# Altium schematic sheet Assistant_Parameters.SchDoc: EMRT MAIN CONTROLLER
size A4; DrawnBy: HUST; DocumentNumber: 9321-E-1101; Revision: REV.B; SheetNumber: 4; SheetTotal: 4
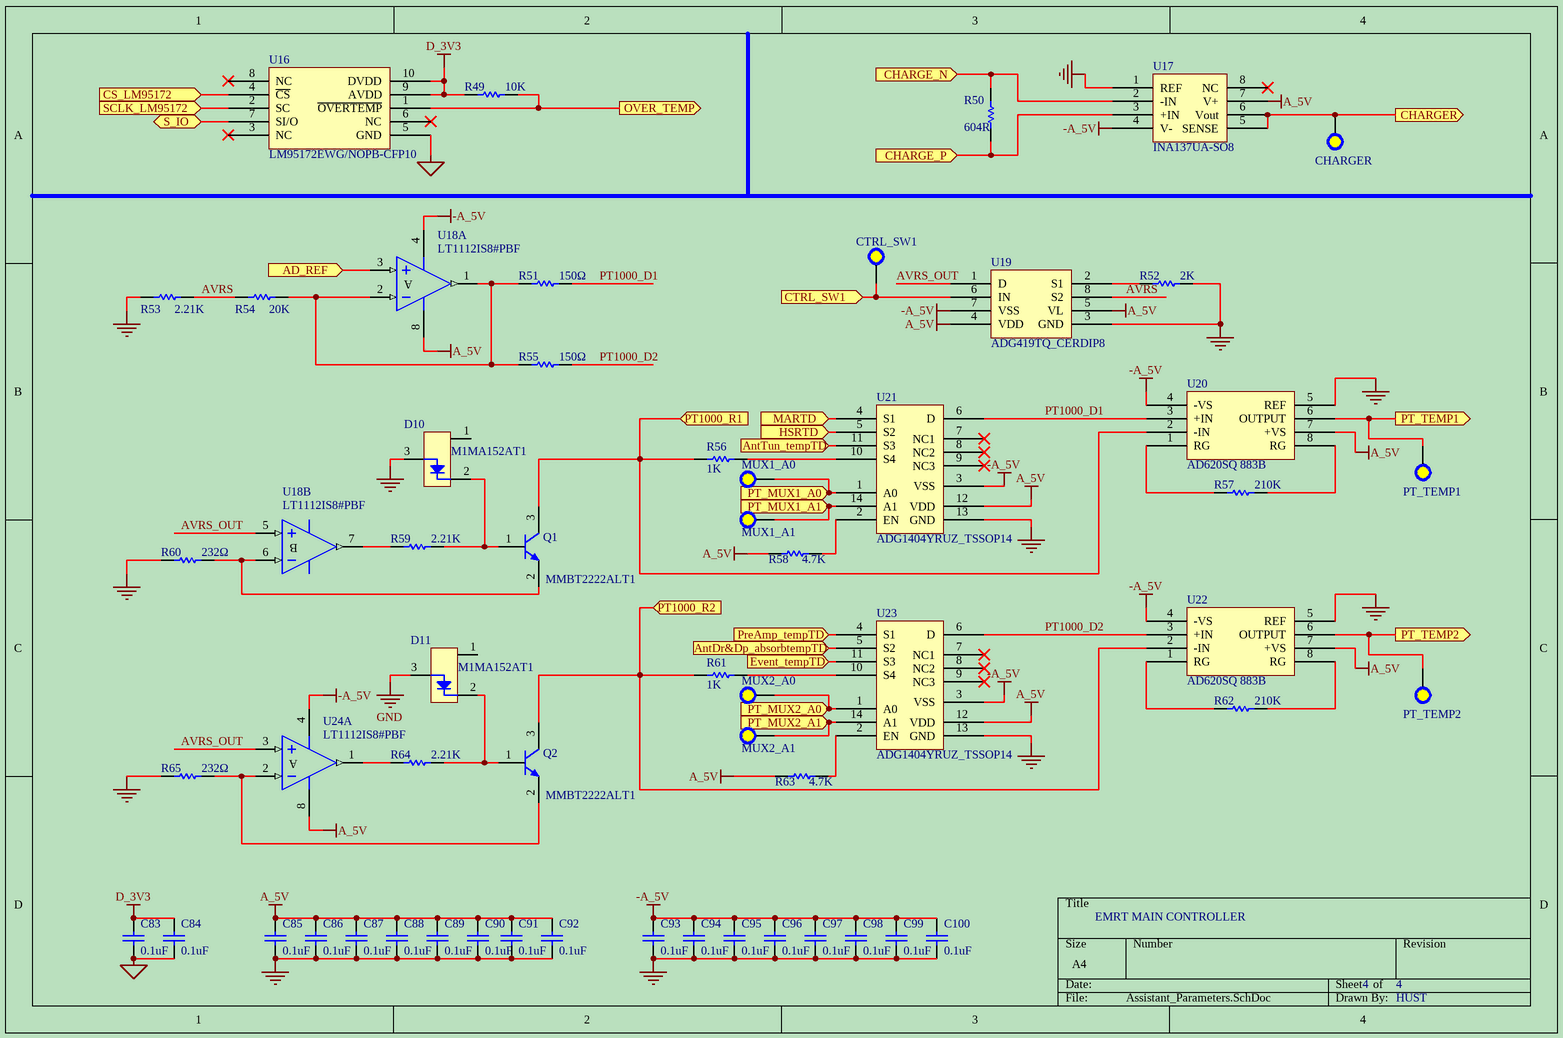
[diagram p0: Assistant_Parameters.SchDoc]

## Parts
C83  value 0.1uF  [CAPS0805_57]  (hidden comment: Cap)
C84  value 0.1uF  [CAPS0805_57]  (hidden comment: Cap)
C85  value 0.1uF  [CAPS0805_57]  (hidden comment: Cap)
C86  Cap  [CAPS0805_57]  (value not drawn)
C87  value 0.1uF  [CAPS0805_57]  (hidden comment: Cap)
C88  value 0.1uF  [CAPS0805_57]  (hidden comment: Cap)
C89  value 0.1uF  [CAPS0805_57]  (hidden comment: Cap)
C90  value 0.1uF  [CAPS0805_57]  (hidden comment: Cap)
C91  value 0.1uF  [CAPS0805_57]  (hidden comment: Cap)
C92  value 0.1uF  [CAPS0805_57]  (hidden comment: Cap)
C93  value 0.1uF  [CAPS0805_57]  (hidden comment: Cap)
C94  Cap  [CAPS0805_57]  (value not drawn)
C95  value 0.1uF  [CAPS0805_57]  (hidden comment: Cap)
C96  value 0.1uF  [CAPS0805_57]  (hidden comment: Cap)
C97  value 0.1uF  [CAPS0805_57]  (hidden comment: Cap)
C98  value 0.1uF  [CAPS0805_57]  (hidden comment: Cap)
C99  value 0.1uF  [CAPS0805_57]  (hidden comment: Cap)
C100  value 0.1uF  [CAPS0805_57]  (hidden comment: Cap)
CHARGER  TEST_SMALL  [test_small]  (value not drawn)
CTRL_SW1  TEST_SMALL  [test_small]  (value not drawn)
D10  M1MA152AT1  [SC-59]
D11  M1MA152AT1  [SC-59]
MUX1_A0  TEST_SMALL  [test_small]  (value not drawn)
MUX1_A1  TEST_SMALL  [test_small]  (value not drawn)
MUX2_A0  TEST_SMALL  [test_small]  (value not drawn)
MUX2_A1  TEST_SMALL  [test_small]  (value not drawn)
PT_TEMP1  TEST_SMALL  [test_small]  (value not drawn)
PT_TEMP2  TEST_SMALL  [test_small]  (value not drawn)
Q1  MMBT2222ALT1  [V-PDSO_3q290×240×100_p190]
Q2  MMBT2222ALT1  [V-PDSO_3q290×240×100_p190]
R49  value 10K  [RESS0805]  (hidden comment: Res)
R50  value 604R  [RESS0805]  (hidden comment: Res)
R51  value 150Ω  [RESS0805]  (hidden comment: Res)
R52  value 2K  [RESS0805]  (hidden comment: Res)
R53  value 2.21K  [RESS0805]  (hidden comment: Res)
R54  value 20K  [RESS0805]  (hidden comment: Res)
R55  value 150Ω  [RESS0805]  (hidden comment: Res)
R56  value 1K  [RESS0805]  (hidden comment: Res)
R57  value 210K  [RESS0805]  (hidden comment: Res)
R58  value 4.7K  [RESS0805]  (hidden comment: Res)
R59  value 2.21K  [RESS0805]  (hidden comment: Res)
R60  value 232Ω  [RESS0805]  (hidden comment: Res)
R61  value 1K  [RESS0805]  (hidden comment: Res)
R62  value 210K  [RESS0805]  (hidden comment: Res)
R63  value 4.7K  [RESS0805]  (hidden comment: Res)
R64  value 2.21K  [RESS0805]  (hidden comment: Res)
R65  value 232Ω  [RESS0805]  (hidden comment: Res)
U16  LM95172EWG/NOPB-CFP10  [SOP10]
U17  INA137UA-SO8  [PDSO_8q600×490×175_p127]
U18  LT1112IS8#PBF  [PDSO_8q600×490×175_p127]  (parts A,B of 2)
U19  ADG419TQ_CERDIP8  [CDIP_8q405×305×200_d19_p100_i300]
U20  AD620SQ 883B  [CDIP_8q405×305×200_d19_p100_i300]
U21  ADG1404YRUZ_TSSOP14  [TSSOP14]
U22  AD620SQ 883B  [CDIP_8q405×305×200_d19_p100_i300]
U23  ADG1404YRUZ_TSSOP14  [TSSOP14]
U24  LT1112IS8#PBF  [PDSO_8q600×490×175_p127]  (part A of 2)

## Ports
AD_REF (in), AntDr&Dp_absorbtempTD (in), AntTun_tempTD (in), CHARGE_N (in), CHARGE_P (in), CHARGER (out), CS_LM95172 (in), CTRL_SW1 (in), Event_tempTD (in), HSRTD (in), MARTD (in), OVER_TEMP (out), PreAmp_tempTD (in), PT1000_R1 (in), PT1000_R2 (in), PT_MUX1_A0 (in), PT_MUX1_A1 (in), PT_MUX2_A0 (in), PT_MUX2_A1 (in), PT_TEMP1 (out), PT_TEMP2 (out), S_IO (bidir), SCLK_LM95172 (in)

## Nets
-A_5V: C93.2 C94.1 C95.2 C96.2 C97.2 C98.2 C99.2 C100.2 U17.4(V-) U18.4(V-) U19.7(VSS) U20.4(-VS) U21.3(VSS) U22.4(-VS) U23.3(VSS) U24.4(V-)
A_5V: C85.2 C86.1 C87.2 C88.1 C89.2 C90.2 C91.2 C92.2 R58.1 R63.1 U17.7(V+) U18.8(V+) U19.4(VDD) U19.5(VL) U20.7(+VS) U21.12(VDD) U22.7(+VS) U23.12(VDD) U24.8(V+)
D_3V3: C83.2 C84.2 R49.2 U16.9(AVDD) U16.10(DVDD)
DGND: C83.1 C84.1 U16.5(GND)
GND: C85.1 C86.2 C87.1 C88.2 C89.1 C90.1 C91.1 C92.1 C93.1 C94.2 C95.1 C96.1 C97.1 C98.1 C99.1 C100.1 D10.3 D11.3 R52.1 R53.2 R60.2 R65.2 U17.1(REF) U19.3(GND) U20.5(REF) U21.13(GND) U22.5(REF) U23.13(GND)
AD_REF: U18.3(IN+) ; port AD_REF
AntDr&Dp_absorbtempTD: U23.5(S2) ; port AntDr&Dp_absorbtempTD
AntTun_tempTD: U21.11(S3) ; port AntTun_tempTD
AVRS: R53.1 R54.2 U19.8(S2)
AVRS_OUT: U18.5(IN+) U19.1(D) U24.3(IN+)
CHARGE_N: R50.1 U17.2(-IN) ; port CHARGE_N
CHARGE_P: R50.2 U17.3(+IN) ; port CHARGE_P
CHARGER: CHARGER.1 U17.5(SENSE) U17.6(Vout) ; port CHARGER
CS_LM95172: U16.4(~{CS}) ; port CS_LM95172
CTRL_SW1: CTRL_SW1.1 U19.6(IN) ; port CTRL_SW1
Event_tempTD: U23.11(S3) ; port Event_tempTD
HSRTD: U21.5(S2) ; port HSRTD
MARTD: U21.4(S1) ; port MARTD
OVER_TEMP: R49.1 U16.1(~{OVERTEMP}) ; port OVER_TEMP
PreAmp_tempTD: U23.4(S1) ; port PreAmp_tempTD
PT1000_D1: R51.1 U20.3(+IN) U21.6(D)
PT1000_D2: R55.1 U22.3(+IN) U23.6(D)
PT1000_R1: Q1.3(C) R56.1 U20.2(-IN) ; port PT1000_R1
PT1000_R2: Q2.3(C) R61.1 U22.2(-IN) ; port PT1000_R2
PT_MUX1_A0: MUX1_A0.1 U21.1(A0) ; port PT_MUX1_A0
PT_MUX1_A1: MUX1_A1.1 U21.14(A1) ; port PT_MUX1_A1
PT_MUX2_A0: MUX2_A0.1 U23.1(A0) ; port PT_MUX2_A0
PT_MUX2_A1: MUX2_A1.1 U23.14(A1) ; port PT_MUX2_A1
PT_TEMP1: PT_TEMP1.1 U20.6(OUTPUT) ; port PT_TEMP1
PT_TEMP2: PT_TEMP2.1 U22.6(OUTPUT) ; port PT_TEMP2
S_IO: U16.7(SI/O) ; port S_IO
SCLK_LM95172: U16.2(SC) ; port SCLK_LM95172
NetD10_2: D10.2 Q1.1(B) R59.1
NetD11_2: D11.2 Q2.1(B) R64.1
NetQ1_2: Q1.2(E) R60.1 U18.6(IN-)
NetQ2_2: Q2.2(E) R65.1 U24.2(IN-)
NetR51_2: R51.2 R54.1 R55.2 U18.1(OUT) U18.2(IN-)
NetR52_2: R52.2 U19.2(S1)
NetR56_2: R56.2 U21.10(S4)
NetR57_1: R57.1 U20.8(RG)
NetR57_2: R57.2 U20.1(RG)
NetR58_2: R58.2 U21.2(EN)
NetR59_2: R59.2 U18.7(OUT)
NetR61_2: R61.2 U23.10(S4)
NetR62_1: R62.1 U22.8(RG)
NetR62_2: R62.2 U22.1(RG)
NetR63_2: R63.2 U23.2(EN)
NetR64_2: R64.2 U24.1(OUT)

Not connected (* = marked no-connect by the designer): D10 1; D11 1; U16 3(NC)* 6(NC)* 8(NC)*; U17 8(NC)*; U21 7(NC1)* 8(NC2)* 9(NC3)*; U23 7(NC1)* 8(NC2)* 9(NC3)*

## Notes on the sheet
- (in symbol LT1112IS8#PBF, part A) A
- (in symbol LT1112IS8#PBF, part B) B
- (in symbol Y20002409) 0.1uF

## Library data of the parts
C83 C84 C87 C93 = Y20025084: Capacitor; 制造商型号: VJ0805H104KXA; parent: 01; 精度: ±10%; 描述: VISHAY;VJ0805H104KXA;0.1uF;±10%;50V;X8R;150℃;CAP0805; 安装形式: SMT; 湿敏等级（回流焊峰值）: 0; 产品外形尺寸<长>: 0.079±0.008 in; 产品外形尺寸<宽>: 0.049±0.008 in; 产品外形尺寸<高>: 0.057 in; id: wt.part.WTPartMaster:1053152; state: APPROVED; folder: /Default/电容/VJ0805H104KXA; Part Number: Y20025084; HelpURL: \\10.185.226.160\altium_center_db\DATASHEET\VISHAY VJ X8R.pdf; Library Path: Cap.SchLib; Library Ref: Cap; Footprint Path: VISHAY VJ0805_57.PcbLib; Footprint Ref: CAPS0805_57; pname: VJ0805H104KXA; Library Path 2: 0; Library Ref 2: 0; Footprint Path 2: 0; Footprint Ref 2: 0; Footprint Path 3: 0; Footprint Ref 3: 0
C85 C88-C92 C95-C100 = Y20024100: Capacitor; 制造商型号: C0805C104J5RAC; 精度: ±5%; 描述: KEMET;C0805C104J5RAC;0.1uF;±5%;50V;X7R;125℃;CAP0805 MSL1; 安装形式: SMT; 湿敏等级（回流焊峰值）: MSL1; 产品外形尺寸<长>: 2.0±0.2mm; 产品外形尺寸<宽>: 1.25±0.2mm; 产品外形尺寸<高>: 0.78±0.1mm; id: wt.part.WTPartMaster:1054484; state: APPROVED; folder: /Default/电容/C0805C104J5RAC; Part Number: Y20024100; HelpURL: \\10.185.226.160\altium_center_db\DATASHEET\KEMET X7R Dielectric(Commercial Grade).pdf; pname: C0805C104J5RAC
C86 C94 = Y20002409: Capacitor; 精度: ±5%; 描述: AVX;CCR05CG200JP;20pF;30±ppm/℃;±5%;200V;125℃;CAP RADIAL; 安装形式: THT; 产品外形尺寸<长>: 4.83±0.25mm; 产品外形尺寸<宽>: 2.29±0.25mm; pname: CCR05CG200JP; id: wt.part.WTPartMaster:1052659; state: APPROVED; folder: /Default/电容/CCR05CG200JP; Part Number: Y20002409; 产品外形尺寸<高>: 4.83±0.25mm; HelpURL: \\10.185.226.160\altium_center_db\DATASHEET\AVX MIL-PRF-20RADIAL&AXIAL.pdf; 制造商型号: CCR05CG200JP
D10 D11 = M1MA152AT1: Part Number: Y20032999
Q1 Q2 = MMBT2222ALT1: General Purpose Transistor NPN Silicon
R49-R65 = Res: Semiconductor Resistor; Manufacturer: Generic Components; Class: Passive; Published: 08/06/2000; Publisher: Altium Hobart Technology Centre; SubClass: Resistor
U16 = LM95172EWG/NOPB
U17 = INA137
U18 U24 = LT1112IS8#PBF: Precision, Single-Supply Dual Operational Amplifier
U19 = ADG419TQ/883
U20 U22 = AD620
U21 U23 = ADG1404